# Altium schematic sheet POWER_1.5V_6A.SchDoc
size A4
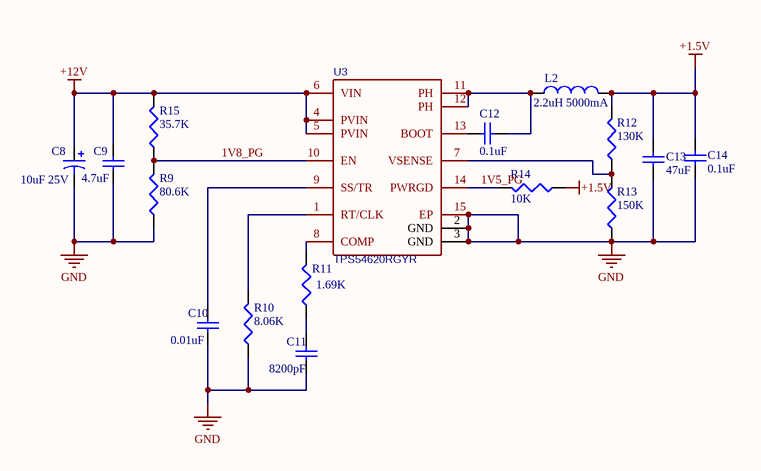
[diagram p0: POWER_1.5V_6A.SchDoc]

## Parts
C8  value 10uF 25V  [47UF_16V]  (hidden comment: Cap Pol1)
C9  value 4.7uF  [C1210]  (hidden comment: Cap Semi)
C10  value 0.01uF  [C1210]  (hidden comment: Cap Semi)
C11  value 8200pF  [C1210]  (hidden comment: Cap Semi)
C12  value 0.1uF  [C1210]  (hidden comment: Cap Semi)
C13  value 47uF  [C1210]  (hidden comment: Cap Semi)
C14  value 0.1uF  [C1210]  (hidden comment: Cap Semi)
L2  value 2.2uH 5000mA  [IND-SMD_L5.5-W5.2]  (hidden comment: Inductor)
R9  value 80.6K  [J1-0603]  (hidden comment: Res3)
R10  value 8.06K  [J1-0603]  (hidden comment: Res3)
R11  value 1.69K  [J1-0603]  (hidden comment: Res3)
R12  value 130K  [J1-0603]  (hidden comment: Res3)
R13  value 150K  [J1-0603]  (hidden comment: Res3)
R14  value 10K  [J1-0603]  (hidden comment: Res3)
R15  value 35.7K  [J1-0603]  (hidden comment: Res3)
U3  TPS54620RGYR  [VQFN-14_L3.5-W3.5-P0.50-TL-EP_TPS54622RHLT]

## Nets
+1.5V: C13.1 C14.1 L2.2 R12.2 R14.1
+12V: C8.1 C9.2 R15.2 U3.4(PVIN) U3.5(PVIN) U3.6(VIN)
GND: C8.2 C9.1 C10.1 C11.1 C13.2 C14.2 R9.1 R10.1 R13.1 U3.2(GND) U3.3(GND) U3.15(EP)
1V5_PG: R14.2 U3.14(PWRGD)
1V8_PG: R9.2 R15.1 U3.10(EN)
NetC10_2: C10.2 U3.9(SS/TR)
NetC11_2: C11.2 R11.1
NetC12_1: C12.1 L2.1 U3.11(PH) U3.12(PH)
NetC12_2: C12.2 U3.13(BOOT)
NetR10_2: R10.2 U3.1(RT/CLK)
NetR11_2: R11.2 U3.8(COMP)
NetR12_1: R12.1 R13.2 U3.7(VSENSE)

## Library data of the parts
C8 = Cap Pol1: Polarized Capacitor (Radial); Published: 8-Jun-2000; LatestRevisionDate: 17-Jul-2002; LatestRevisionNote: Re-released for DXP Platform.; PackageReference: RB7.6-15; Publisher: Altium Limited; PackageDescription: Polarized Capacitor (Radial); 2 Leads
C9-C14 = Cap Semi: Capacitor (Semiconductor SIM Model); Published: 8-Jun-2000; LatestRevisionDate: 29-May-2009; LatestRevisionNote: IPC-7351 Footprint Added.; PackageReference: C1206; Publisher: Altium Limited; PackageDescription: Chip Capacitor
L2 = Inductor: Code_IEC: 1005; Published: 8-Jun-2000; LatestRevisionDate: 29-May-2009; LatestRevisionNote: IPC-7351 Footprint Added.; PackageReference: 0402-A; Publisher: Altium Limited; PackageDescription: Chip Inductor; Code_JEITA: 0402
R9-R15 = Res3: Resistor; Published: 8-Jun-2000; LatestRevisionDate: 29-May-2009; LatestRevisionNote: IPC-7351 Footprint Added.; PackageReference: J1-0603; Publisher: Altium Limited; PackageDescription: Chip Resistor
U3 = TPS54620RGYR: BOM_Manufacturer: TI; BOM_Supplier: LCSC; BOM_Manufacturer Part: TPS54620RGYR; image: //image.lceda.cn/szlcsc/C29438.jpg; BOM_Supplier Part: C29438; spicePre: U; spiceSymbolName: TPS54620RGYR